# Altium schematic sheet Extern.SchDoc
size A4; SheetNumber: 2; SheetTotal: 2
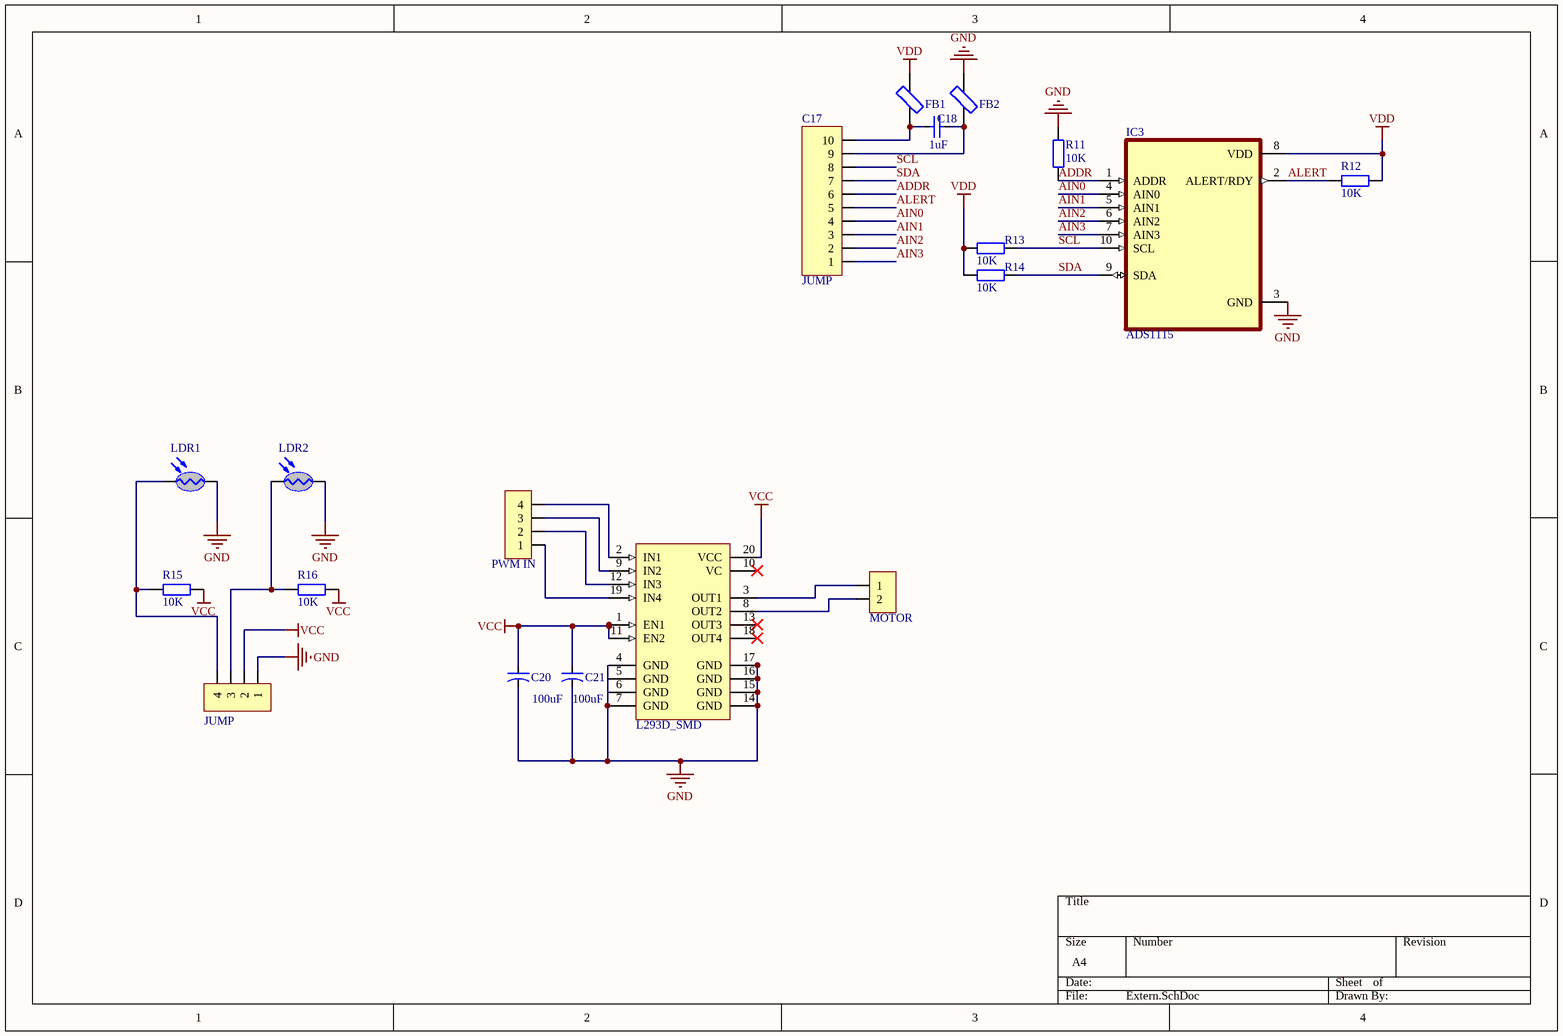
[diagram p0: Extern.SchDoc]

## Parts
C17  JUMP  [JP10-C1T]
C18  1uF  [CAP_0402]
C19  PWM IN  [JP4-C1T]
C20  100uF  [CA-ALU-2.54]
C21  100uF  [CA-ALU-2.54]
C22  JUMP  [JP4-C1T]
FB1  Ferrit Bead  [RES-SMD-0805]  (value not drawn)
FB2  Ferrit Bead  [RES-SMD-0805]  (value not drawn)
IC3  ADS1115  [SOP50P490X110-10N]
J3  MOTOR  [JP2-C1T]
LDR1  LDR  [CDS]  (value not drawn)
LDR2  LDR  [CDS]  (value not drawn)
R11  10K  [RES-SMD-0101]
R12  10K  [RES-SMD-0101]
R13  10K  [RES-SMD-0101]
R14  10K  [RES-SMD-0101]
R15  10K  [RES-SMD-0101]
R16  10K  [RES-SMD-0101]
U3  L293D_SMD  [SO20]

## Nets
GND: C20.2 C21.2 C22.1 FB2.2 IC3.3(GND) LDR1.1(A) LDR2.1(A) R11.1 U3.7(GND) U3.14(GND) U3.15(GND) U3.16(GND) U3.17(GND)
VCC: C20.1 C21.1 C22.2 R15.1 R16.1 U3.1(EN1) U3.11(EN2) U3.20(VCC)
VDD: FB1.2 IC3.8(VDD) R12.1 R13.2 R14.2
ADDR: C17.6 IC3.1(ADDR) R11.2
AIN0: C17.4 IC3.4(AIN0)
AIN1: C17.3 IC3.5(AIN1)
AIN2: C17.2 IC3.6(AIN2)
AIN3: C17.1 IC3.7(AIN3)
ALERT: C17.5 IC3.2(ALERT/RDY) R12.2
SCL: C17.8 IC3.10(SCL) R13.1
SDA: C17.7 IC3.9(SDA) R14.1
NetC17_9: C17.9 C18.2 FB2.1
NetC17_10: C17.10 C18.1 FB1.1
NetC19_1: C19.1 U3.19(IN4)
NetC19_2: C19.2 U3.12(IN3)
NetC19_3: C19.3 U3.9(IN2)
NetC19_4: C19.4 U3.2(IN1)
NetC22_3: C22.3 LDR2.2(K) R16.2
NetC22_4: C22.4 LDR1.2(K) R15.2
NetJ3_1: J3.1 U3.3(OUT1)
NetJ3_2: J3.2 U3.8(OUT2)

Not connected (* = marked no-connect by the designer): U3 4(GND) 5(GND) 6(GND) 10(VC)* 13(OUT3)* 18(OUT4)*

## Library data of the parts
C17 = JP10: WR-PHD 2.54 mm Angled Socket Header; Manufacturer: W¨¹rth Elektronik eiSos GmbH; partNo: 613010143121; ComponentLink1 Description: Manufacturer; ComponentLink2 Description: Datasheet; NoPins: 10; Created Date: 29 March 2013; ComponentLink1URL: http://www.we-online.com; ComponentLink2URL: http://katalog.we-online.de/em/datasheet/6130xx143121.pdf; Created by: Karrer Zheng
C18 = CapSMD: Capacitor; Value: 33p; Published: 8-Jun-2000; LatestRevisionDate: 17-Jul-2002; LatestRevisionNote: Re-released for DXP Platform.; PackageReference: RAD-0.3; Publisher: Altium Limited
C19 C22 = JP4: WR-PHD 2.54 mm Angled Socket Header; Manufacturer: W¨¹rth Elektronik eiSos GmbH; partNo: 613004143121; ComponentLink1 Description: Manufacturer; ComponentLink2 Description: Datasheet; NoPins: 04; Created Date: 29 March 2013; ComponentLink1URL: http://www.we-online.com; ComponentLink2URL: http://katalog.we-online.de/em/datasheet/6130xx143121.pdf; Created by: Karrer Zheng
C20 C21 = CAP-ALU-DIP: Capacitor (Semiconductor SIM Model); Value: 104; LatestRevisionDate: 17-Jul-2002; LatestRevisionNote: Re-released for DXP Platform.; PackageReference: C1206; Publisher: Altium Limited
FB1 FB2 = Ferrit Bead: Generic Ferrit Bead
IC3 = ADS1115: 16 bits 4 channals ADC IC
J3 = JP2: WR-PHD 2.54 mm Angled Socket Header; Manufacturer: W¨¹rth Elektronik eiSos GmbH; partNo: 613002143121; ComponentLink1 Description: Manufacturer; ComponentLink2 Description: Datasheet; NoPins: 02; Created Date: 29 March 2013; ComponentLink1URL: http://www.we-online.com; ComponentLink2URL: http://katalog.we-online.de/em/datasheet/6130xx143121.pdf; Created by: Karrer Zheng
LDR1 LDR2 = LDR: Quang Tro
R11-R16 = Resistor - SMD: Resistor SMD; Manufacturer: Generic Components; Class: Passive; Published: 08/06/2000; Publisher: Altium Hobart Technology Centre
U3 = L293D_SMD: Push-Pull Four Channel Driver With Diode; Published: 8-Jun-2000; LatestRevisionDate: 06-Jun-2005; LatestRevisionNote: Stylized 3D Model Added.; DatasheetVersion: Jun-1996; PackageVersion: Apr-1996; PackageReference: DIP16; Publisher: Altium Limited; PackageDescription: DIP; 16 Leads; Row Spacing 7.62 mm; Pitch 2.54 mm; ComponentLink1Description: Manufacturer Link; ComponentLink1URL: http://www.st.com/; ComponentLink2Description: Datasheet; ComponentLink2URL: http://www.st.com/stonline/products/literature/ds/1330/l293d.pdf